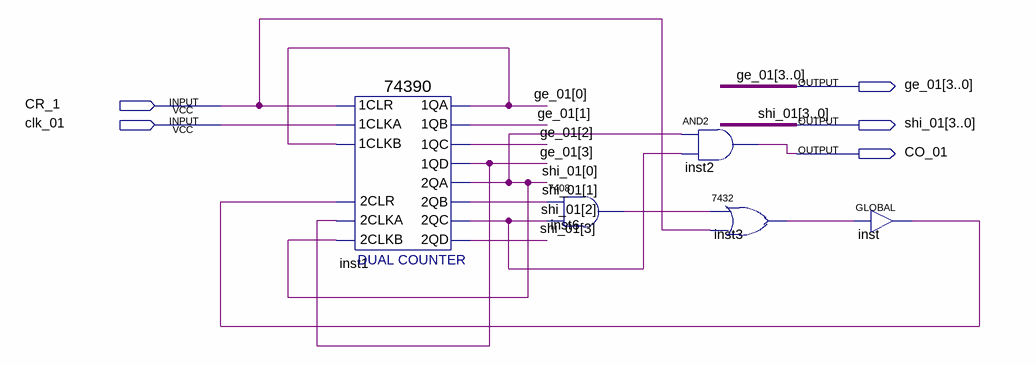
[diagram p0: schematic sheet]
// Quartus schematic cnt60.bdf as structural Verilog: 5 symbols, 5 pins
module cnt60 (
  input  CR_1,
  input  clk_01,
  output [3:0] ge_01,
  output [3:0] shi_01,
  output CO_01
);

  wire inst3_1, inst6_1, inst_out;

  \74390  inst1 (
    .\2CLKA (ge_01[3]), .\2CLR (inst_out), .\2CLKB (shi_01[0]), .\1CLR (CR_1), .\1CLKA (clk_01),
    .\1CLKB (ge_01[0]), .\1QA (ge_01[0]), .\1QB (ge_01[1]), .\1QC (ge_01[2]), .\1QD (ge_01[3]),
    .\2QA (shi_01[0]), .\2QB (shi_01[1]), .\2QC (shi_01[2]), .\2QD (shi_01[3]));
  \7408  inst6 (.\3 (shi_01[2]), .\2 (shi_01[1]), .\1 (inst6_1));
  and inst2 (CO_01, shi_01[0], shi_01[2]);
  \7432  inst3 (.\2 (inst6_1), .\3 (CR_1), .\1 (inst3_1));
  GLOBAL inst (.IN(inst3_1), .OUT(inst_out));
endmodule
